# Altium schematic sheet inout.SchDoc
size A0
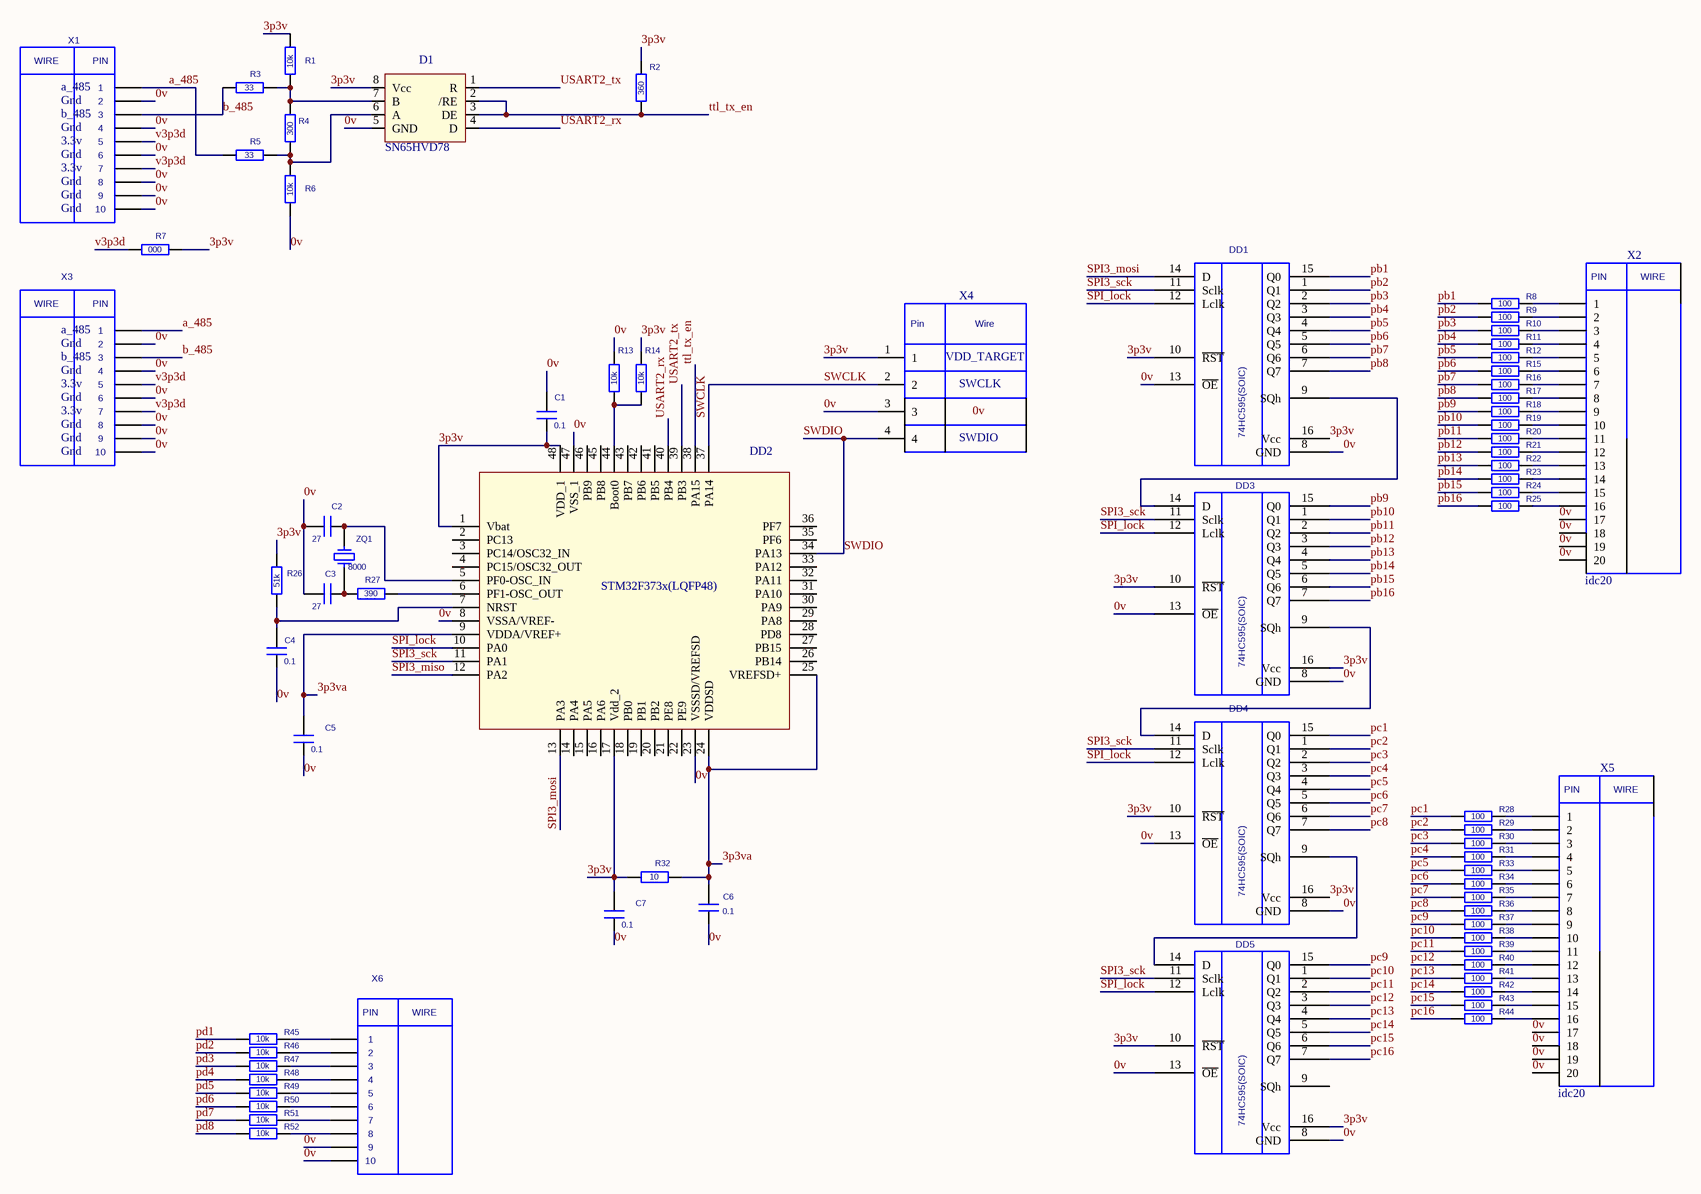
[diagram p0: inout.SchDoc]

## Parts
C1  value 0.1  [CC0805]  (hidden comment: CAP0805)
C2  value 27  [CC0805]  (hidden comment: CAP0805)
C3  value 27  [CC0805]  (hidden comment: CAP0805)
C4  value 0.1  [CC0805]  (hidden comment: CAP0805)
C5  value 0.1  [CC0805]  (hidden comment: CAP0805)
C6  value 0.1  [CC0805]  (hidden comment: CAP0805)
C7  value 0.1  [CC0805]  (hidden comment: CAP0805)
D1  SN65HVD78  [8S1_M]
DD1  74HC595(SOIC)  [SO16]
DD2  STM32F373x(LQFP48)  [LQFP48_L]
DD3  74HC595(SOIC)  [SO16]
DD4  74HC595(SOIC)  [SO16]
DD5  74HC595(SOIC)  [SO16]
R1  value 10k  [RC0805]  (hidden comment: 1K 1% 0805(2012))
R2  value 360  [RC0805]  (hidden comment: 1K 1% 0805(2012))
R3  value 33  [RC0805]  (hidden comment: 1K 1% 0805(2012))
R4  value 300  [RC0805]  (hidden comment: 1K 1% 0805(2012))
R5  value 33  [RC0805]  (hidden comment: 1K 1% 0805(2012))
R6  value 10k  [RC0805]  (hidden comment: 1K 1% 0805(2012))
R7  value 000  [RC0805]  (hidden comment: 1K 1% 0805(2012))
R8  value 100  [RC0805]  (hidden comment: 1K 1% 0805(2012))
R9  value 100  [RC0805]  (hidden comment: 1K 1% 0805(2012))
R10  value 100  [RC0805]  (hidden comment: 1K 1% 0805(2012))
R11  value 100  [RC0805]  (hidden comment: 1K 1% 0805(2012))
R12  value 100  [RC0805]  (hidden comment: 1K 1% 0805(2012))
R13  value 10k  [RC0805]  (hidden comment: RES0805)
R14  value 10k  [RC0805]  (hidden comment: RES0805)
R15  value 100  [RC0805]  (hidden comment: 1K 1% 0805(2012))
R16  value 100  [RC0805]  (hidden comment: 1K 1% 0805(2012))
R17  value 100  [RC0805]  (hidden comment: 1K 1% 0805(2012))
R18  value 100  [RC0805]  (hidden comment: 1K 1% 0805(2012))
R19  value 100  [RC0805]  (hidden comment: 1K 1% 0805(2012))
R20  value 100  [RC0805]  (hidden comment: 1K 1% 0805(2012))
R21  value 100  [RC0805]  (hidden comment: 1K 1% 0805(2012))
R22  value 100  [RC0805]  (hidden comment: 1K 1% 0805(2012))
R23  value 100  [RC0805]  (hidden comment: 1K 1% 0805(2012))
R24  value 100  [RC0805]  (hidden comment: 1K 1% 0805(2012))
R25  value 100  [RC0805]  (hidden comment: 1K 1% 0805(2012))
R26  value 51k  [RC0805]  (hidden comment: RES0805)
R27  value 390  [RC0805]  (hidden comment: RES0805)
R28  value 100  [RC0805]  (hidden comment: 1K 1% 0805(2012))
R29  value 100  [RC0805]  (hidden comment: 1K 1% 0805(2012))
R30  value 100  [RC0805]  (hidden comment: 1K 1% 0805(2012))
R31  value 100  [RC0805]  (hidden comment: 1K 1% 0805(2012))
R32  value 10  [RC0805]  (hidden comment: RES0805)
R33  value 100  [RC0805]  (hidden comment: 1K 1% 0805(2012))
R34  value 100  [RC0805]  (hidden comment: 1K 1% 0805(2012))
R35  value 100  [RC0805]  (hidden comment: 1K 1% 0805(2012))
R36  value 100  [RC0805]  (hidden comment: 1K 1% 0805(2012))
R37  value 100  [RC0805]  (hidden comment: 1K 1% 0805(2012))
R38  value 100  [RC0805]  (hidden comment: 1K 1% 0805(2012))
R39  value 100  [RC0805]  (hidden comment: 1K 1% 0805(2012))
R40  value 100  [RC0805]  (hidden comment: 1K 1% 0805(2012))
R41  value 100  [RC0805]  (hidden comment: 1K 1% 0805(2012))
R42  value 100  [RC0805]  (hidden comment: 1K 1% 0805(2012))
R43  value 100  [RC0805]  (hidden comment: 1K 1% 0805(2012))
R44  value 100  [RC0805]  (hidden comment: 1K 1% 0805(2012))
R45  value 10k  [RC0805]  (hidden comment: 1K 1% 0805(2012))
R46  value 10k  [RC0805]  (hidden comment: 1K 1% 0805(2012))
R47  value 10k  [RC0805]  (hidden comment: 1K 1% 0805(2012))
R48  value 10k  [RC0805]  (hidden comment: 1K 1% 0805(2012))
R49  value 10k  [RC0805]  (hidden comment: 1K 1% 0805(2012))
R50  value 10k  [RC0805]  (hidden comment: 1K 1% 0805(2012))
R51  value 10k  [RC0805]  (hidden comment: 1K 1% 0805(2012))
R52  value 10k  [RC0805]  (hidden comment: 1K 1% 0805(2012))
X1  IDC10  [IDC10M]  (value not drawn)
X2  idc20  [IDC20M]
X3  IDC10  [IDC10M]  (value not drawn)
X4  *  [4pin]  (value not drawn)
X5  idc20  [IDC20M]
X6  IDC10  [IDC10M]  (value not drawn)
ZQ1  value 8000  [CRYSTAL_Primary]  (hidden comment: REZONATOR)

## Nets
0v: C1.2 C2.2 C3.2 C4.1 C5.1 C6.1 C7.1 D1.5(GND) DD1.8(GND) DD1.13(~{OE}) DD2.8(VSSA/VREF-) DD2.23(VSSSD/VREFSD) DD2.47(VSS_1) DD3.8(GND) DD3.13(~{OE}) DD4.8(GND) DD4.13(~{OE}) DD5.8(GND) DD5.13(~{OE}) R6.2 R13.2 X1.2 X1.4 X1.6 X1.8 X1.9 X1.10 X2.17 X2.18 X2.19 X2.20 X3.2 X3.4 X3.6 X3.8 X3.9 X3.10 X4.3 X5.17 X5.18 X5.19 X5.20 X6.9 X6.10
3p3v: C1.1 C7.2 D1.8(Vcc) DD1.10(~{RST}) DD1.16(Vcc) DD2.1(Vbat) DD2.17(Vdd_2) DD2.48(VDD_1) DD3.10(~{RST}) DD3.16(Vcc) DD4.10(~{RST}) DD4.16(Vcc) DD5.10(~{RST}) DD5.16(Vcc) R1.1 R2.1 R7.2 R14.2 R26.2 R32.1 X4.1
3p3va: C5.2 C6.2 DD2.9(VDDA/VREF+) DD2.24(VDDSD) DD2.25(VREFSD+) R32.2
a_485: R5.1 X1.1 X3.1
b_485: R3.1 X1.3 X3.3
pb1: DD1.15(Q0) R8.2
pb2: DD1.1(Q1) R9.2
pb3: DD1.2(Q2) R10.2
pb4: DD1.3(Q3) R11.2
pb5: DD1.4(Q4) R12.2
pb6: DD1.5(Q5) R15.2
pb7: DD1.6(Q6) R16.2
pb8: DD1.7(Q7) R17.2
pb9: DD3.15(Q0) R18.2
pb10: DD3.1(Q1) R19.2
pb11: DD3.2(Q2) R20.2
pb12: DD3.3(Q3) R21.2
pb13: DD3.4(Q4) R22.2
pb14: DD3.5(Q5) R23.2
pb15: DD3.6(Q6) R24.2
pb16: DD3.7(Q7) R25.2
pc1: DD4.15(Q0) R28.2
pc2: DD4.1(Q1) R29.2
pc3: DD4.2(Q2) R30.2
pc4: DD4.3(Q3) R31.2
pc5: DD4.4(Q4) R33.2
pc6: DD4.5(Q5) R34.2
pc7: DD4.6(Q6) R35.2
pc8: DD4.7(Q7) R36.2
pc9: DD5.15(Q0) R37.2
pc10: DD5.1(Q1) R38.2
pc11: DD5.2(Q2) R39.2
pc12: DD5.3(Q3) R40.2
pc13: DD5.4(Q4) R41.2
pc14: DD5.5(Q5) R42.2
pc15: DD5.6(Q6) R43.2
pc16: DD5.7(Q7) R44.2
pd1: R45.2
pd2: R46.2
pd3: R47.2
pd4: R48.2
pd5: R49.2
pd6: R50.2
pd7: R51.2
pd8: R52.2
SPI3_miso: DD2.12(PA2)
SPI3_mosi: DD1.14(D) DD2.13(PA3)
SPI3_sck: DD1.11(Sclk) DD2.11(PA1) DD3.11(Sclk) DD4.11(Sclk) DD5.11(Sclk)
SPI_lock: DD1.12(Lclk) DD2.10(PA0) DD3.12(Lclk) DD4.12(Lclk) DD5.12(Lclk)
SWCLK: DD2.37(PA14) X4.2
SWDIO: DD2.34(PA13) X4.4
ttl_tx_en: D1.2(/RE) D1.3(DE) DD2.38(PA15) R2.2
USART2_rx: D1.4(D) DD2.40(PB4)
USART2_tx: D1.1(R) DD2.39(PB3)
v3p3d: R7.1 X1.5 X1.7 X3.5 X3.7
NetC2_1: C2.1 DD2.5(PF0-OSC_IN) ZQ1.2
NetC3_1: C3.1 R27.2 ZQ1.1
NetC4_2: C4.2 DD2.7(NRST) R26.1
NetD1_6: D1.6(A) R4.2 R5.2 R6.1
NetD1_7: D1.7(B) R1.2 R3.2 R4.1
NetDD1_9: DD1.9(SQh) DD3.14(D)
NetDD2_6: DD2.6(PF1-OSC_OUT) R27.1
NetDD2_44: DD2.44(Boot0) R13.1 R14.1
NetDD3_9: DD3.9(SQh) DD4.14(D)
NetDD4_9: DD4.9(SQh) DD5.14(D)
NetR8_1: R8.1 X2.1
NetR9_1: R9.1 X2.2
NetR10_1: R10.1 X2.3
NetR11_1: R11.1 X2.4
NetR12_1: R12.1 X2.5
NetR15_1: R15.1 X2.6
NetR16_1: R16.1 X2.7
NetR17_1: R17.1 X2.8
NetR18_1: R18.1 X2.9
NetR19_1: R19.1 X2.10
NetR20_1: R20.1 X2.11
NetR21_1: R21.1 X2.12
NetR22_1: R22.1 X2.13
NetR23_1: R23.1 X2.14
NetR24_1: R24.1 X2.15
NetR25_1: R25.1 X2.16
NetR28_1: R28.1 X5.1
NetR29_1: R29.1 X5.2
NetR30_1: R30.1 X5.3
NetR31_1: R31.1 X5.4
NetR33_1: R33.1 X5.5
NetR34_1: R34.1 X5.6
NetR35_1: R35.1 X5.7
NetR36_1: R36.1 X5.8
NetR37_1: R37.1 X5.9
NetR38_1: R38.1 X5.10
NetR39_1: R39.1 X5.11
NetR40_1: R40.1 X5.12
NetR41_1: R41.1 X5.13
NetR42_1: R42.1 X5.14
NetR43_1: R43.1 X5.15
NetR44_1: R44.1 X5.16
NetR45_1: R45.1 X6.1
NetR46_1: R46.1 X6.2
NetR47_1: R47.1 X6.3
NetR48_1: R48.1 X6.4
NetR49_1: R49.1 X6.5
NetR50_1: R50.1 X6.6
NetR51_1: R51.1 X6.7
NetR52_1: R52.1 X6.8

Not connected (* = marked no-connect by the designer): DD2 2(PC13) 3(PC14/OSC32_IN) 4(PC15/OSC32_OUT) 14(PA4) 15(PA5) 16(PA6) 18(PB0) 19(PB1) 20(PB2) 21(PE8) 22(PE9) 26(PB14) 27(PB15) 28(PD8) 29(PA8) 30(PA9) 31(PA10) 32(PA11) 33(PA12) 35(PF6) 36(PF7) 41(PB5) 42(PB6) 43(PB7) 45(PB8) 46(PB9); DD5 9(SQh)

## Notes on the sheet
- a_485
- b_485
- Gnd
- 3.3v
- (near X4) VDD_TARGET
- SWCLK
- SWDIO
- Labels drawn without touching a wire or pin: 0v
- (in symbol 4pin) Pin; Wire
- (in symbol IDC10) WIRE; PIN
- (in symbol idc20) PIN; WIRE

## Library data of the parts
R1-R12 R15-R25 R28-R31 R33-R52 = RES0805
X4 = 4pin
DD1 DD3-DD5 = 74HC595(SOIC): Value: *
X1 X3 X6 = IDC10: Value: *